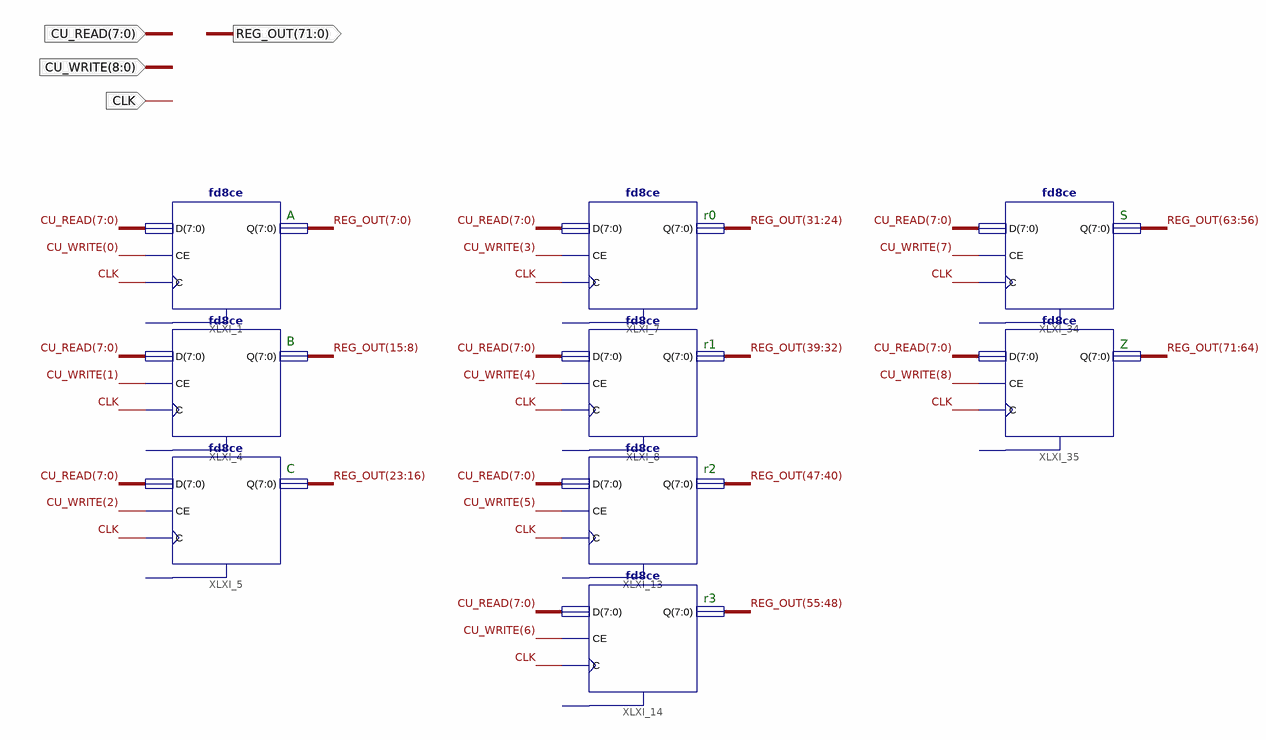
[diagram p0: schematic sheet 1]
// Xilinx ISE schematic Registers.sch (spartan3e) as structural Verilog: 9 symbols, 4 ports
module Registers (
  input  [7:0] CU_READ,
  input  CLK,
  input  [8:0] CU_WRITE,
  output [71:0] REG_OUT
);

  fd8ce XLXI_1 (.C(CLK), .CE(CU_WRITE[0]), .D(CU_READ), .Q(REG_OUT[7:0]));  // open: CLR
  fd8ce XLXI_4 (.C(CLK), .CE(CU_WRITE[1]), .D(CU_READ), .Q(REG_OUT[15:8]));  // open: CLR
  fd8ce XLXI_5 (.C(CLK), .CE(CU_WRITE[2]), .D(CU_READ), .Q(REG_OUT[23:16]));  // open: CLR
  fd8ce XLXI_7 (.C(CLK), .CE(CU_WRITE[3]), .D(CU_READ), .Q(REG_OUT[31:24]));  // open: CLR
  fd8ce XLXI_8 (.C(CLK), .CE(CU_WRITE[4]), .D(CU_READ), .Q(REG_OUT[39:32]));  // open: CLR
  fd8ce XLXI_13 (.C(CLK), .CE(CU_WRITE[5]), .D(CU_READ), .Q(REG_OUT[47:40]));  // open: CLR
  fd8ce XLXI_14 (.C(CLK), .CE(CU_WRITE[6]), .D(CU_READ), .Q(REG_OUT[55:48]));  // open: CLR
  fd8ce XLXI_34 (.C(CLK), .CE(CU_WRITE[7]), .D(CU_READ), .Q(REG_OUT[63:56]));  // open: CLR
  fd8ce XLXI_35 (.C(CLK), .CE(CU_WRITE[8]), .D(CU_READ), .Q(REG_OUT[71:64]));  // open: CLR

  // Notes on the sheet:
  //   A
  //   r0
  //   S
  //   B
  //   r1
  //   Z
  //   C
  //   r2
  //   r3
endmodule
